# Altium schematic sheet laser_driver.SchDoc
size A
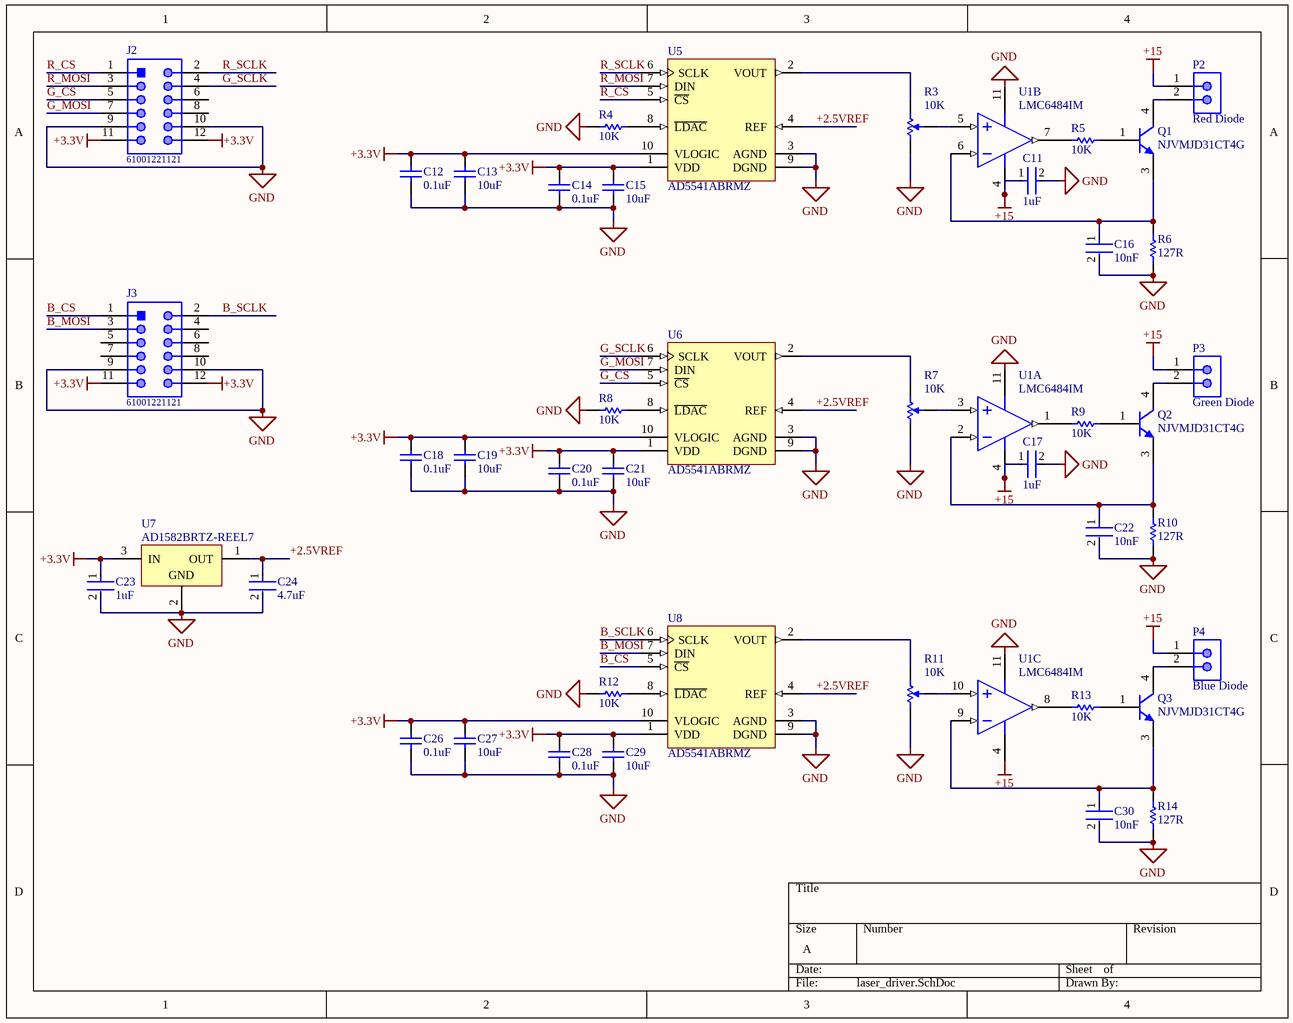
[diagram p0: laser_driver.SchDoc]

## Parts
C11  1uF  [FP-CC0603-DA-MFG]
C12  0.1uF  [CAPC1608X87X35NL15T15]
C13  10uF  [CAPC1608X90X35NL10T15]
C14  0.1uF  [CAPC1608X87X35NL15T15]
C15  10uF  [CAPC1608X90X35NL10T15]
C16  10nF  [FP-CGA3E-0_3-0_1-IPC_A]
C17  1uF  [FP-CC0603-DA-MFG]
C18  0.1uF  [CAPC1608X87X35NL15T15]
C19  10uF  [CAPC1608X90X35NL10T15]
C20  0.1uF  [CAPC1608X87X35NL15T15]
C21  10uF  [CAPC1608X90X35NL10T15]
C22  10nF  [FP-CGA3E-0_3-0_1-IPC_A]
C23  1uF  [FP-CC0603-DA-MFG]
C24  4.7uF  [FP-C0603-CG-MFG]
C26  0.1uF  [CAPC1608X87X35NL15T15]
C27  10uF  [CAPC1608X90X35NL10T15]
C28  0.1uF  [CAPC1608X87X35NL15T15]
C29  10uF  [CAPC1608X90X35NL10T15]
C30  10nF  [FP-CGA3E-0_3-0_1-IPC_A]
J2  61001221121  [61001221121]
J3  61001221121  [61001221121]
P2  Red Diode  [JST-B2B-XH-A_V]
P3  Green Diode  [JST-B2B-XH-A_V]
P4  Blue Diode  [JST-B2B-XH-A_V]
Q1  NJVMJD31CT4G  [ONSC-DPAK-3-369C-01_V]
Q2  NJVMJD31CT4G  [ONSC-DPAK-3-369C-01_V]
Q3  NJVMJD31CT4G  [ONSC-DPAK-3-369C-01_V]
R3  10K  [BOUR-3313J-1_V]
R4  10K  [RESC1609X55X30LL15T15]
R5  10K  [RESC1609X55X30LL15T15]
R6  127R  [RESC1608X55X30LL15T15]
R7  10K  [BOUR-3313J-1_V]
R8  10K  [RESC1609X55X30LL15T15]
R9  10K  [RESC1609X55X30LL15T15]
R10  127R  [RESC1608X55X30LL15T15]
R11  10K  [BOUR-3313J-1_V]
R12  10K  [RESC1609X55X30LL15T15]
R13  10K  [RESC1609X55X30LL15T15]
R14  127R  [RESC1608X55X30LL15T15]
U1  LMC6484IM  [D0014A_N]  (parts A,B,C of 4)
U5  AD5541ABRMZ  [RM-10_L]
U6  AD5541ABRMZ  [RM-10_L]
U7  AD1582BRTZ-REEL7  [ADI-RT-3_M]
U8  AD5541ABRMZ  [RM-10_L]

## Nets
+3.3V: C12.1 C13.2 C14.1 C15.2 C18.1 C19.2 C20.1 C21.2 C23.1 C26.1 C27.2 C28.1 C29.2 J2.11 J2.12 J3.11 J3.12 U5.1(VDD) U5.10(VLOGIC) U6.1(VDD) U6.10(VLOGIC) U7.3(IN) U8.1(VDD) U8.10(VLOGIC)
+15: C11.1 C17.1 P2.1 P3.1 P4.1 U1.4(V+)
GND: C11.2 C12.2 C13.1 C14.2 C15.1 C16.2 C17.2 C18.2 C19.1 C20.2 C21.1 C22.2 C23.2 C24.2 C26.2 C27.1 C28.2 C29.1 C30.2 J2.9 J2.10 J3.9 J3.10 R3.1 R4.2 R6.1 R7.1 R8.2 R10.1 R11.1 R12.2 R14.1 U1.11(V-) U5.3(AGND) U5.9(DGND) U6.3(AGND) U6.9(DGND) U7.2(GND) U8.3(AGND) U8.9(DGND)
+2.5VREF: C24.1 U5.4(REF) U6.4(REF) U7.1(OUT) U8.4(REF)
B_CS: J3.1 U8.5(~{CS})
B_MOSI: J3.3 U8.7(DIN)
B_SCLK: J3.2 U8.6(SCLK)
G_CS: J2.5 U6.5(~{CS})
G_MOSI: J2.7 U6.7(DIN)
G_SCLK: J2.4 U6.6(SCLK)
R_CS: J2.1 U5.5(~{CS})
R_MOSI: J2.3 U5.7(DIN)
R_SCLK: J2.2 U5.6(SCLK)
NetC16_1: C16.1 Q1.3(E) R6.2 U1.6(IN2-)
NetC22_1: C22.1 Q2.3(E) R10.2 U1.2(IN1-)
NetC30_1: C30.1 Q3.3(E) R14.2 U1.9(IN3-)
NetP2_2: P2.2 Q1.4(C)
NetP3_2: P3.2 Q2.4(C)
NetP4_2: P4.2 Q3.4(C)
NetQ1_1: Q1.1(B) R5.2
NetQ2_1: Q2.1(B) R9.2
NetQ3_1: Q3.1(B) R13.2
NetR3_2: R3.2 U1.5(IN2+)
NetR3_3: R3.3 U5.2(VOUT)
NetR4_1: R4.1 U5.8(~{LDAC})
NetR5_1: R5.1 U1.7(OUT2)
NetR7_2: R7.2 U1.3(IN1+)
NetR7_3: R7.3 U6.2(VOUT)
NetR8_1: R8.1 U6.8(~{LDAC})
NetR9_1: R9.1 U1.1(OUT1)
NetR11_2: R11.2 U1.10(IN3+)
NetR11_3: R11.3 U8.2(VOUT)
NetR12_1: R12.1 U8.8(~{LDAC})
NetR13_1: R13.1 U1.8(OUT3)

Not connected (* = marked no-connect by the designer): J2 6 8; J3 4 5 6 7 8

## Library data of the parts
C11 C17 C23 = CMP-03422-000924-1: CAP CER 1UF 16V X7R 0603; Manufacturer: YAGEO; Manufacturer Part Number: CC0603KRX7R7BB105; Tolerance: 0.1; Temperature Coefficient: 15%; Material: Ceramic; Package: CC0603-DA; RoHS: TRUE; Device Class L2: Capacitors; Temperature Characteristic: X7R; Temperature: -55°C to +125°C; Temperature Range Low: -55°C; Automotive: No; ComponentLink2Description: Datasheet; Value: 1 uF; Lead Free: Yes; Capacitance: 1 uF; ComponentLink2URL: http://www.yageo.com/documents/recent/UPY-GPHC_X7R_6.3V-to-50V_18.pdf; Device Class L1: Passive Components; Voltage: 16 V; Octopart: https://octopart.com/cc0603krx7r7bb105-yageo-42271928; Category: Cap; Digikey Description: CAP CER 1UF 16V X7R 0603; Footprint Url: http://www.yageo.com/exep/pages/download/literatures/UPY-C_GEN_24.pdf; Height: 0.9mm; Voltage Rating: 16 V; Temperature Range High: +125°C; Mouser Description: Multilayer Ceramic Capacitor, CC Series, 1 - F, - 10%, X7R, 16 V, 0603 [1608 Metric]; Device Class L3: Ceramic Capacitors
C12 C14 C18 C20 C26 C28 = CMP-2006-03300-1: C0603X104K5RACTU; Manufacturer: Kemet; Part Number: C0603X104K5RACTU
C13 C15 C19 C21 C27 C29 = CMP-2006-02792-1: GRM188R60J106ME47D; Manufacturer: Murata; Part Number: GRM188R60J106ME47D
C16 C22 C30 = CMP-08246-000769-1: Cap Ceramic 10nF 100V X8R 10% Pad SMD 0603 +150°C Automotive T/R; Mount: Surface Mount; Voltage Rating (DC): 100V; Termination: SMD/SMT; Dielectric: X8R; Case/Package: 0603; Ratings: AEC-Q200; Voltage Rating: 100V; Capacitance: 10nF; Packaging: Tape and Reel; Thickness: 0.035inch; Composition: Ceramic; Max Operating Temperature: 150°C; Width: 0.031inch; Height: 0.8mm; Weight: 7.1E-05oz; Depth: 0.8mm; Min Operating Temperature: -55°C; Length: 1.6mm; Case Code (Metric): 1608; Tolerance: 10%; Package Quantity: 4000; Case Code (Imperial): 0603
C24 = CMP-03020-024641-1: CAP CER 4.7UF 6.3V X5R 0603; Manufacturer: Kemet; Manufacturer Part Number: C0603C475K9PACTU; Temperature Coefficient: 15%; Tolerance: 10%; Material: Ceramic; Device Class L3: Ceramic Capacitors; RoHS: TRUE; Value: 4.7uF; Lead Free: Yes; ComponentLink2Description: Datasheet; Mouser Description: Multilayer Ceramic Capacitors MLCC - SMD/SMT 6.3volts 4.7uF X5R 10%; Package: C0603-CG; Digikey Description: CAP CER 4.7UF 6.3V X5R 0603; ComponentLink2URL: https://content.kemet.com/datasheets/KEM_C1006_X5R_SMD.pdf; Category: Cap; Temperature Range Low: -55°C; Capacitance: 4.7uF; Temperature: -55°C to +85°C; Octopart: https://octopart.com/c0603c475k9pactu-kemet-104242; Ipc Land Pattern Name: CAPC16080X80; Voltage Rating: 6.3V; Temperature Range High: +85°C; Height: 0.9mm; Temperature Characteristic: X5R; Device Class L1: Passive Components; Automotive: No; Device Class L2: Capacitors
J2 J3 = CMP-1502-01029-1: SMT Vertical Pin Header WR-PHD, Pitch 2.54 mm, Dual Row, 12 pins; Manufacturer: Wurth Elektronik; Working Voltage: 250VAC; Pin Number: 12; Withstanding Voltage: 500VAC; Contact Resistance: 20mOhm; Rated Current: 3A; Gender: Male; Pitch: 2.54mm; Publisher: WurthElektronik; Packaging: Tube; Part Number: 61001221121; Row Number: Dual; Mounting Technology: SMT; Manufacturer URL: http://www.we-online.de; Operating Temperature: -40to125degC; Datasheet URL: https://katalog.we-online.de/em/datasheet/6100xx21121.pdf; Orientation: Vertical; Package Reference: 61001221121
P2-P4 = CMP-2000-05888-1: Male Header, Pitch 2.5 mm, 1 x 2 Position, Height 7 mm, Tail Length 3.4 mm, -25 to 85 degC, RoHS, Bulk; Manufacturer: JST; No of Positions: 2; Pitch: 2.5mm; Style/Orientation: StraightHeader/Plug; Datasheet Version: 05/2016; Package Description: Male Header, Pitch 2.5 mm, 1 x 2 Position, Height 7 mm, Tail Length 3.4 mm; Package Reference: B2B-XH-A; Mounting Technology: ThroughHole; Type: ShroudedHeader; Datasheet URL: http://www.jst-mfg.com/product/pdf/eng/eXH.pdf; Manufacturer URL: http://www.jst.com/home2.html; Termination: Crimp
Q1-Q3 = CMP-1048-00119-1: Complementary Power Transistor, 3-Pin DPAK, Pb-Free, Tape and Reel; Manufacturer: On Semiconductor; fT Min (MHz): 3; Polarity: NPN; RoHS: TRUE; Mounting Technology: Surface Mount; ComponentLink1Description: Manufacturer URL; ComponentLink3URL: http://www.onsemi.cn/pub_link/Collateral/369C.PDF; PackageDescription: 3-Pin Flange Mount, Body 6.54 x 6.095 mm, Pitch 2.29 mm; ComponentLink2Description: Datasheet; DatasheetVersion: Rev. 13; PackageVersion: Rev. E, 02/2014; ComponentLink3Description: Package Specification; Packing: Tape and Reel; ComponentLink2URL: http://www.onsemi.cn/pub_link/Collateral/MJD31-D.PDF; PackageReference: DPAK-3-369C-01; PartNumber: NJVMJD31CT4G; IC Continuous (A): 3; ComponentLink1URL: http://www.onsemi.com/
R3 R7 R11 = CMP-2000-05585-1: Trimming Potentiometer, 10 KOhm, -55 to 125 degC, 3-Pin SMD, RoHS, Tape and Reel; Manufacturer: Bourns; Resistance Tolerance: ±20%; Track Resistance: 10kohm; SVHC: NoSVHC(16-Jun-2014); No. of Turns: 1; Temperature Coefficient: ±100ppm/°C; Power Rating: 125mW; Potentiometer Mounting: SMD; RoHS Compliant: Yes; Datasheet URL: http://www.bourns.com/docs/Product-Datasheets/3313.pdf; Mounting Technology: SurfaceMount; Manufacturer URL: http://www.bourns.com/; Package Description: 3-Pin Surface Mount Device, Body 3.5 x 3.2 mm, Pitch 1.15 mm; Package Reference: 3313J-1; Datasheet Version: 05/2016
R4 R5 R8 R9 R12 R13 = CMP-2000-07452-1: Chip Resistor, 10 KOhm, +/- 1%, 0.1 W, -55 to 155 degC, 0603 (1608 Metric), RoHS, Tape and Reel; Manufacturer: Panasonic; Voltage Rating: 75V; Case\/Package: 0603; Power Rating: 100mW; Resistance: 10KOhm; Temperature Coefficient: 100ppm\/degreesC; Number of Pins: 2; Package Reference: 603; Depth: 0.8mm; Mount: SurfaceMount; Package Description: 2-Pin Surface Mount Device, Body 1.6 x 0.85 mm; Datasheet Version: 02/2017; Length: 1.6mm; Lead Free: LeadFree; Height: 0.45mm; Number of Terminations: 2; Max Power Dissipation: 100mW; Min Operating Temperature: -55degC; Datasheet URL: https://industrial.panasonic.com/cdbs/www-data/pdf/RDA0000/AOA0000C304.pdf; Termination: SMD/SMT; Case Code (Metric): 1608; Case Code (Imperial): 0603; Tolerance: 1%; Max Operating Temperature: 155degC; RoHSCompliant: true; Voltage Rating (DC): 75V; Radiation Hardening: No; Packaging: TapeandReel; Composition: ThickFilm; Mounting Technology: SurfaceMount; Manufacturer URL: http://www.panasonic.com/; Width: 0.031inch; REACH SVHC: NoSVHC; Contact Plating: Tin; Military Standard: Not; Package Quantity: 1
R6 R10 R14 = CMP-2000-00226-1: ERJ-3EKF1270V; Manufacturer: Panasonic; Part Number: ERJ-3EKF1270V
U1 = CMP-0055-00811-3: CMOS Quad Rail to Rail Input and Output Operational Amplifier, 14-pin Narrow SOIC, Pb-Free; Manufacturer: Texas Instruments; CompType: Amplifiers; PowerWise: N; PackageTopMarking: NSUZXYTTE#*LMC6484IM; ComponentLink1Description: Datasheet URL; Package Reference: D0014A; Code_JEDEC: MS-012AB; ComponentLink1URL: http://www.ti.com/general/docs/lit/getliterature.tsp?genericPartNumber=LMC6484&fileType=pdf; Code_IPC: SOIC127P600-14; PackageDescription: Molded Package S.O., .150in Wide, 14 Lead; RoHS: Y; PinCount: 14
U5 U6 U8 = CMP-0318-02105-2: Single 16-Bit Voltage Output Digital-to-Analog Converter with Serial Interface, 2.7 to 5.5 V, -40 to +125 degC, RM-10, Pb-Free, Tube; Manufacturer: Analog Devices; Op Pwr Diss: 600ÂµW; Settling Time: 1Âµs; Max V+: 5.5V; Resolution (Bits): 16; Single Supply: Yes; # DAC Outputs: 1; ComponentLink2Description: Datasheet; ComponentLink2URL: http://www.analog.com/static/imported-files/data_sheets/AD5541A.pdf; RevisionNote: Component URL fixed; PartNumber: AD5541ABRMZ; RoHS: Y; DatasheetVersion: Rev.A; Packing: Tube; ComponentLink4URL: http://www.analog.com/en/digital-to-analog-converters/da-converters/ad5541a/products/product.html; ComponentLink3Description: Package Specification; ComponentLink4Description: Product URL; PackageVersion: May-2005; ComponentLink1URL: http://www.analog.com/en/index.html; Mounting Technology: Surface Mount; PackageReference: RM-10; ComponentLink1Description: Manufacturer URL; ComponentLink3URL: http://www.analog.com/static/imported-files/packages/PKG_PDF/MSOP%28RM%29/RM_10.pdf; Generic Part Number: AD5541A; PackageDescription: 10-Lead Mini Small Outline Package [MSOP]
U7 = CMP-0784-00464-1: Micropower, Precision Series Mode Voltage Reference, 2.5 V Output, 2.7 to 12 V Supply, Industrial, 3-pin SOT23 (RT-3), Reel; Manufacturer: Analog Devices; Vout: 2.5V; Ref Out TC (ppm/C): 18; ComponentLink2URL: http://www.analog.com/static/imported-files/data_sheets/AD1582_1583_1584_1585.pdf; DatasheetVersion: Rev. I; Mounting Technology: Surface Mount; Packing: Reel; PackageDescription: 3-Pin Small Outline Transistor Package, Body 2.9 x 1.3 mm, Pitch 0.96 mm; ComponentLink3Description: Package Specification; PackageVersion: 011909-C, 02/2009; ComponentLink4Description: URL Link1; PackageReference: RT-3; ComponentLink1URL: http://www.analog.com/en/index.html; PartNumber: AD1582BRTZ-REEL7; ComponentLink1Description: Manufacturer URL; ComponentLink2Description: Datasheet; ComponentLink4URL: Product URL:http://www.analog.com/en/special-linear-functions/voltage-references/ad1582/products/product.html; Operating Temp Range: -40 to 125 degC; Code_JEDEC: TO-236-AB; ComponentLink3URL: http:/www.analog.com/static/imported-files/packages/PKG_PDF/SOT-23-3 (RT)/RT_3.pdf